# EasyEDA Pro project RealisticPM_2026-10-08.epro, schematic PM2_5_small
Board Name: PM2_5_small; Create Date: 2025-03-29; Page Name: P1; Project Name: RealisticPM; Schematic Name: PM2_5_small; Update Date: 2025-04-02; Company: EasyEDA.com; Page Size: A4; Version: V1.0
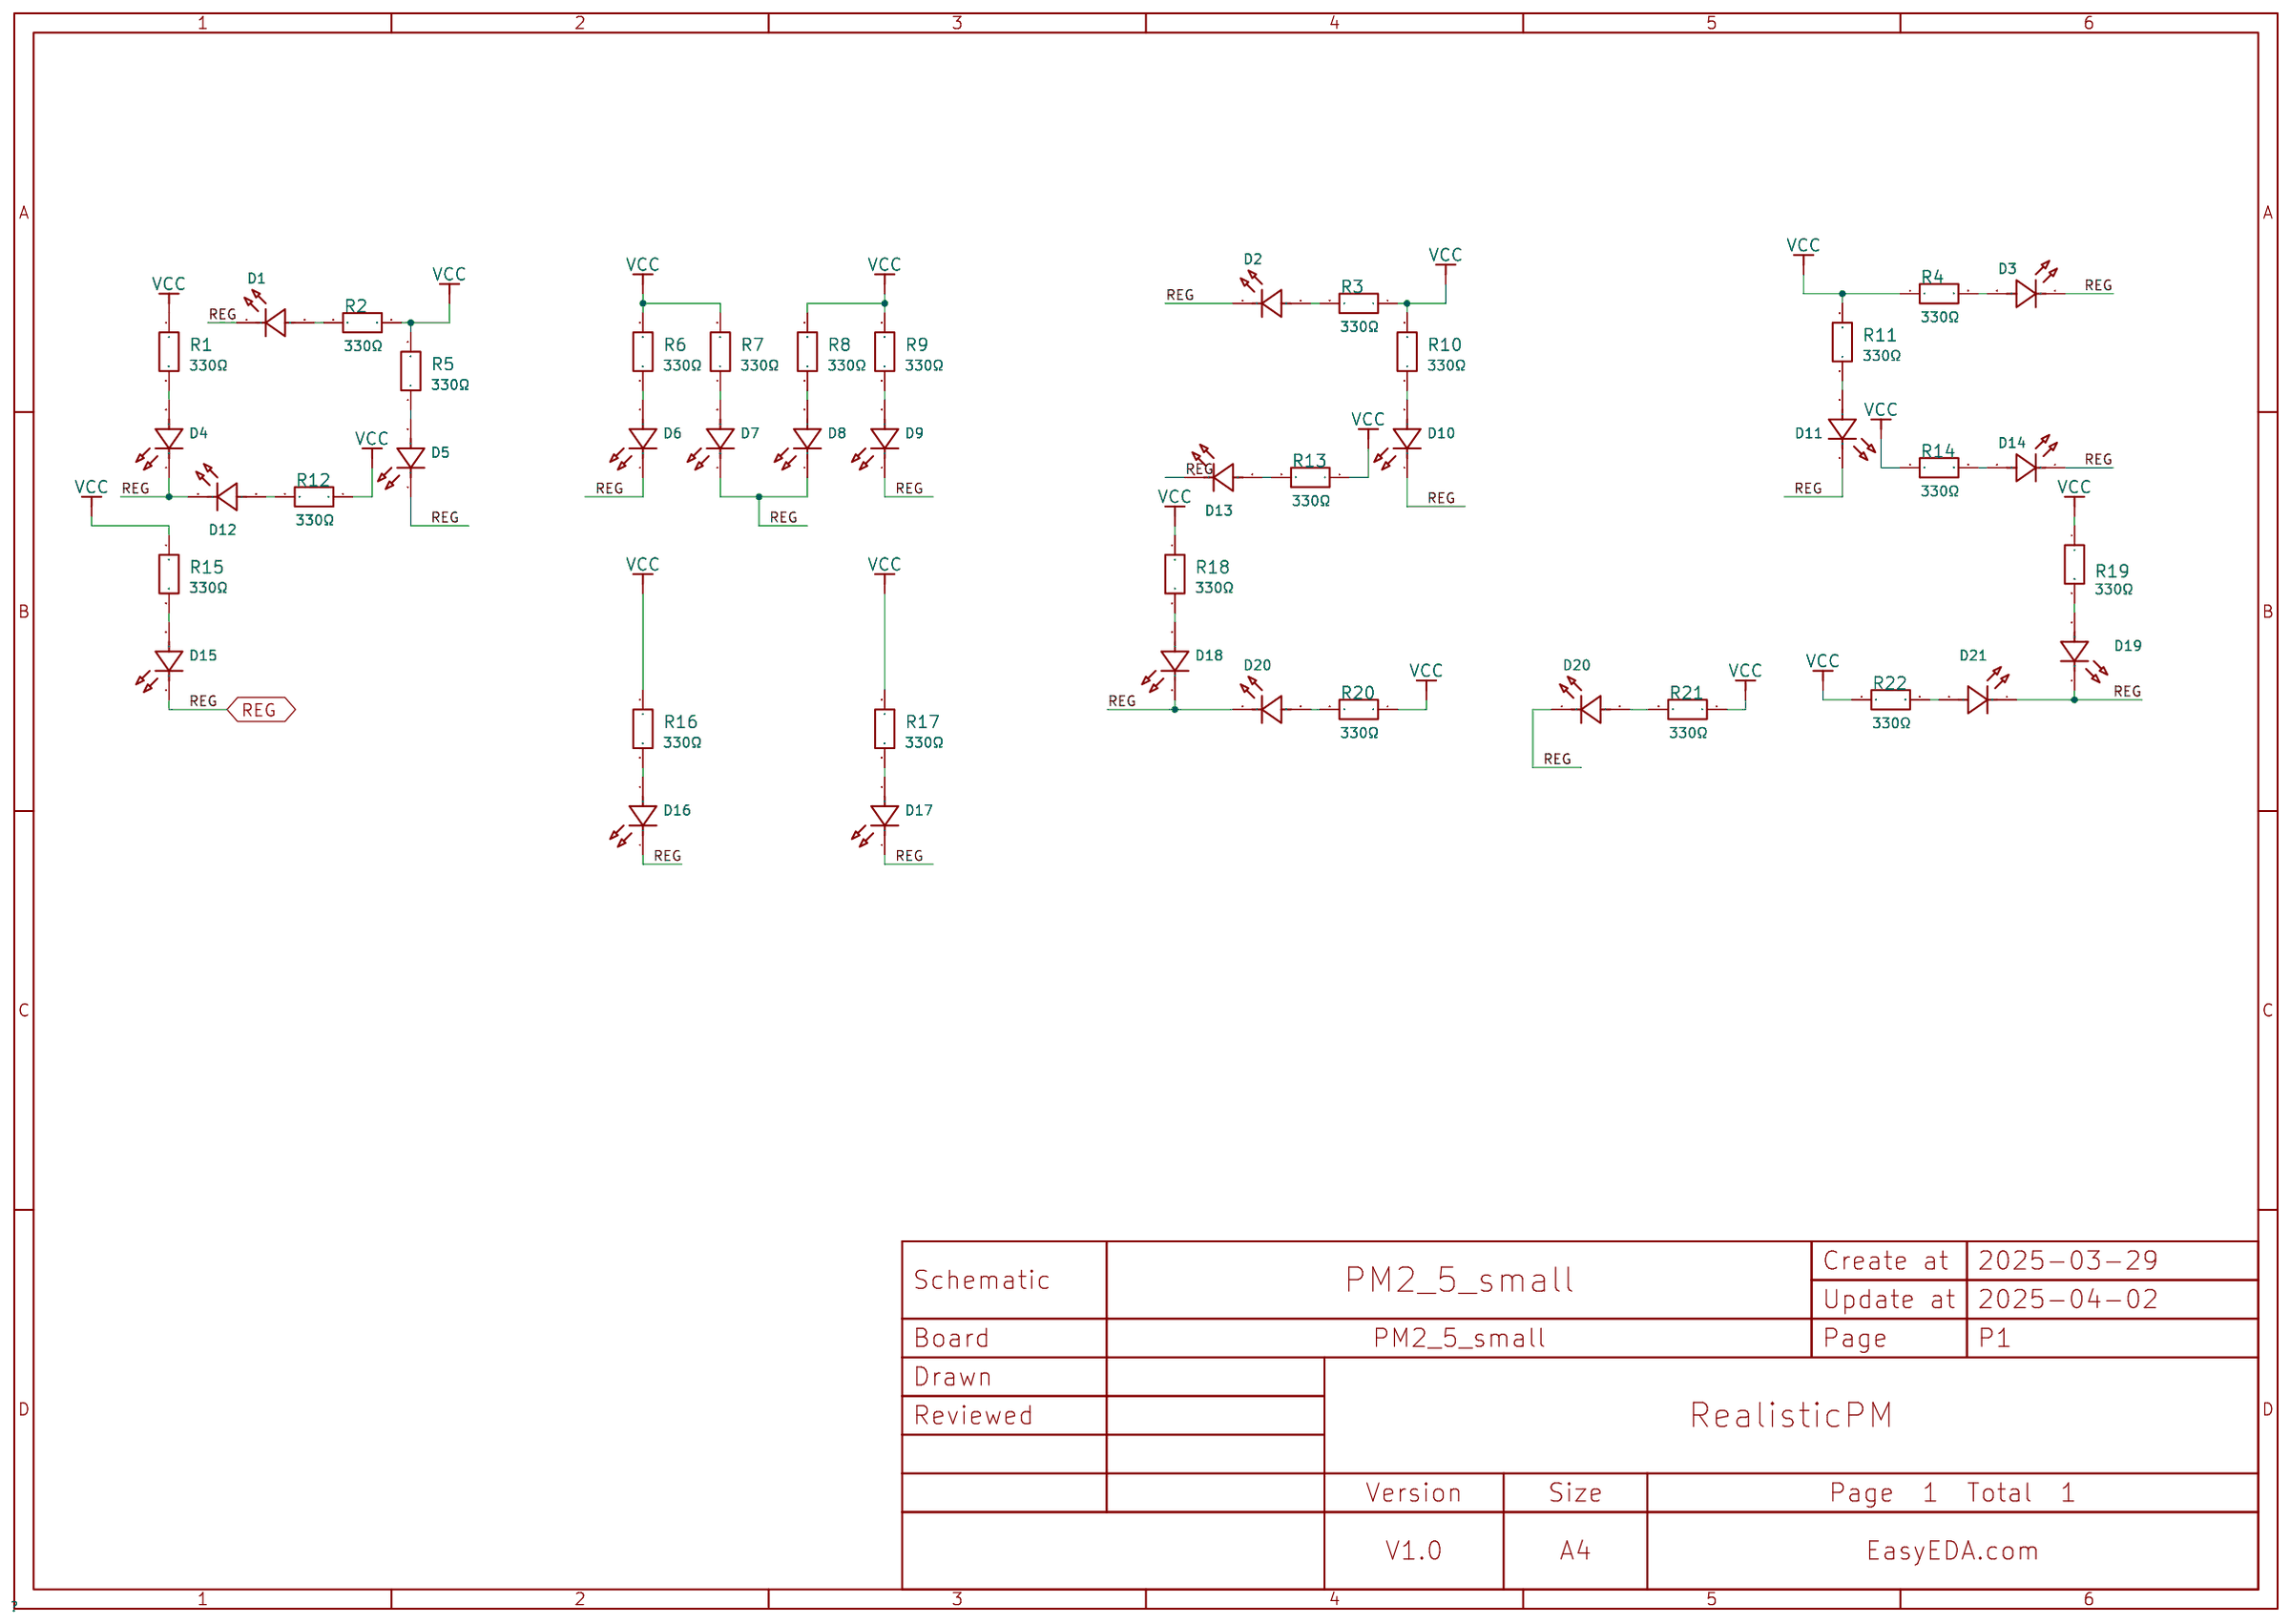
[diagram p0: schematic sheet]

## Parts
D1  GW JCLPS2.CM-GVH3-A131-1-65-2-R33  [LED-SMD_L3.0-W1.4-RD]
D2  GW JCLPS2.CM-GVH3-A131-1-65-2-R33  [LED-SMD_L3.0-W1.4-RD]
D3  GW JCLPS2.CM-GVH3-A131-1-65-2-R33  [LED-SMD_L3.0-W1.4-RD]
D4  GW JCLPS2.CM-GVH3-A131-1-65-2-R33  [LED-SMD_L3.0-W1.4-RD]
D5  GW JCLPS2.CM-GVH3-A131-1-65-2-R33  [LED-SMD_L3.0-W1.4-RD]
D6  GW JCLPS2.CM-GVH3-A131-1-65-2-R33  [LED-SMD_L3.0-W1.4-RD]
D7  GW JCLPS2.CM-GVH3-A131-1-65-2-R33  [LED-SMD_L3.0-W1.4-RD]
D8  GW JCLPS2.CM-GVH3-A131-1-65-2-R33  [LED-SMD_L3.0-W1.4-RD]
D9  GW JCLPS2.CM-GVH3-A131-1-65-2-R33  [LED-SMD_L3.0-W1.4-RD]
D10  GW JCLPS2.CM-GVH3-A131-1-65-2-R33  [LED-SMD_L3.0-W1.4-RD]
D11  GW JCLPS2.CM-GVH3-A131-1-65-2-R33  [LED-SMD_L3.0-W1.4-RD]
D12  GW JCLPS2.CM-GVH3-A131-1-65-2-R33  [LED-SMD_L3.0-W1.4-RD]
D13  GW JCLPS2.CM-GVH3-A131-1-65-2-R33  [LED-SMD_L3.0-W1.4-RD]
D14  GW JCLPS2.CM-GVH3-A131-1-65-2-R33  [LED-SMD_L3.0-W1.4-RD]
D15  GW JCLPS2.CM-GVH3-A131-1-65-2-R33  [LED-SMD_L3.0-W1.4-RD]
D16  GW JCLPS2.CM-GVH3-A131-1-65-2-R33  [LED-SMD_L3.0-W1.4-RD]
D17  GW JCLPS2.CM-GVH3-A131-1-65-2-R33  [LED-SMD_L3.0-W1.4-RD]
D18  GW JCLPS2.CM-GVH3-A131-1-65-2-R33  [LED-SMD_L3.0-W1.4-RD]
D19  GW JCLPS2.CM-GVH3-A131-1-65-2-R33  [LED-SMD_L3.0-W1.4-RD]
D20  GW JCLPS2.CM-GVH3-A131-1-65-2-R33  [LED-SMD_L3.0-W1.4-RD]
D20#2  GW JCLPS2.CM-GVH3-A131-1-65-2-R33  [LED-SMD_L3.0-W1.4-RD]
D21  GW JCLPS2.CM-GVH3-A131-1-65-2-R33  [LED-SMD_L3.0-W1.4-RD]
R1  330Ω  [R0603]
R2  330Ω  [R0603]
R3  330Ω  [R0603]
R4  330Ω  [R0603]
R5  330Ω  [R0603]
R6  330Ω  [R0603]
R7  330Ω  [R0603]
R8  330Ω  [R0603]
R9  330Ω  [R0603]
R10  330Ω  [R0603]
R11  330Ω  [R0603]
R12  330Ω  [R0603]
R13  330Ω  [R0603]
R14  330Ω  [R0603]
R15  330Ω  [R0603]
R16  330Ω  [R0603]
R17  330Ω  [R0603]
R18  330Ω  [R0603]
R19  330Ω  [R0603]
R20  330Ω  [R0603]
R21  330Ω  [R0603]
R22  330Ω  [R0603]

## Library data of the parts
D1-D20 D20#2 D21 = GW JCLPS2.CM-GVH3-A131-1-65-2-R33: Emitted Color:White Forward Voltage (VF):2.95V Forward Voltage (VF):2.95V Forward Current:65mA Color Temperature:6500K Color Temperature:6500K Viewing Angle:120°; LCSC Part Name: 3014白光 0.2W; Supplier Part: C2899256; Manufacturer: OSRAM(欧司朗); Supplier Footprint: SMD,2.8x1.4mm; JLCPCB Part Class: Extended Part; Supplier: LCSC; Emitted Color: White; Forward Voltage (VF): 2.95V; Forward Current: 65mA; Color Temperature: 6500K; Viewing Angle: 120°
R1-R22 = RMS06JT331: Type:Thick Film Resistors Resistance: Tolerance:±5% Tolerance:±5% Power(Watts): Overload Voltage (Max): Temperature Coefficient:±200ppm/℃ Temperature Coefficient:±200ppm/℃ Operating Temperature Range:-55℃~+155℃ Operating Temperature Range:-55℃~+155℃; LCSC Part Name: 厚膜电阻 330Ω ±5% 100mW; Supplier Part: C209237; Manufacturer: 大毅科技; Supplier Footprint: 0603; JLCPCB Part Class: Extended Part; Datasheet: https://atta.szlcsc.com/upload/public/pdf/source/20190313/C209057_DB28D2F9A2E1A0AF6BB7AAA99A28D7CC.pdf; Supplier: LCSC; Type: Thick Film Resistors; Tolerance: ±5%; Temperature Coefficient: ±200ppm/℃; Operating Temperature Range: -55℃~+155℃

## Nets
VCC: R1.1 R2.1 R3.1 R4.1 R5.2 R6.1 R7.2 R8.2 R9.1 R10.2 R11.2 R12.1 R13.1 R14.1 R15.1 R16.1 R17.1 R18.1 R19.1 R20.1 R21.1 R22.1
REG: D1.1(K) D2.1(K) D3.1(K) D4.1(K) D5.1(K) D6.1(K) D7.1(K) D8.1(K) D9.1(K) D10.1(K) D11.1(K) D12.1(K) D13.1(K) D14.1(K) D15.1(K) D16.1(K) D17.1(K) D18.1(K) D19.1(K) D20.1(K) D20#2.1(K) D21.1(K)
$1N510: D12.2(A) R12.2
$1N514: D4.2(A) R1.2
$1N518: D15.2(A) R15.2
$1N521: D1.2(A) R2.2
$1N522: D5.2(A) R5.1
$1N974: D7.2(A) R7.1
$1N981: D16.2(A) R16.2
$1N989: D6.2(A) R6.2
$1N1114: D8.2(A) R8.1
$1N1215: D9.2(A) R9.2
$1N1326: D17.2(A) R17.2
$1N1705: D10.2(A) R10.1
$1N1707: D2.2(A) R3.2
$1N1710: D13.2(A) R13.2
$1N1813: D18.2(A) R18.2
$1N1896: D20.2(A) R20.2
$1N2547: D3.2(A) R4.2
$1N2548: D14.2(A) R14.2
$1N2550: D11.2(A) R11.1
$1N2558: D19.2(A) R19.2
$1N2559: D21.2(A) R22.2
Net-(D20#2-2): D20#2.2(A) R21.2
